# EAGLE schematic control-tu55v6 (EAGLE 6.6.0)

## Sheet 1 of 2
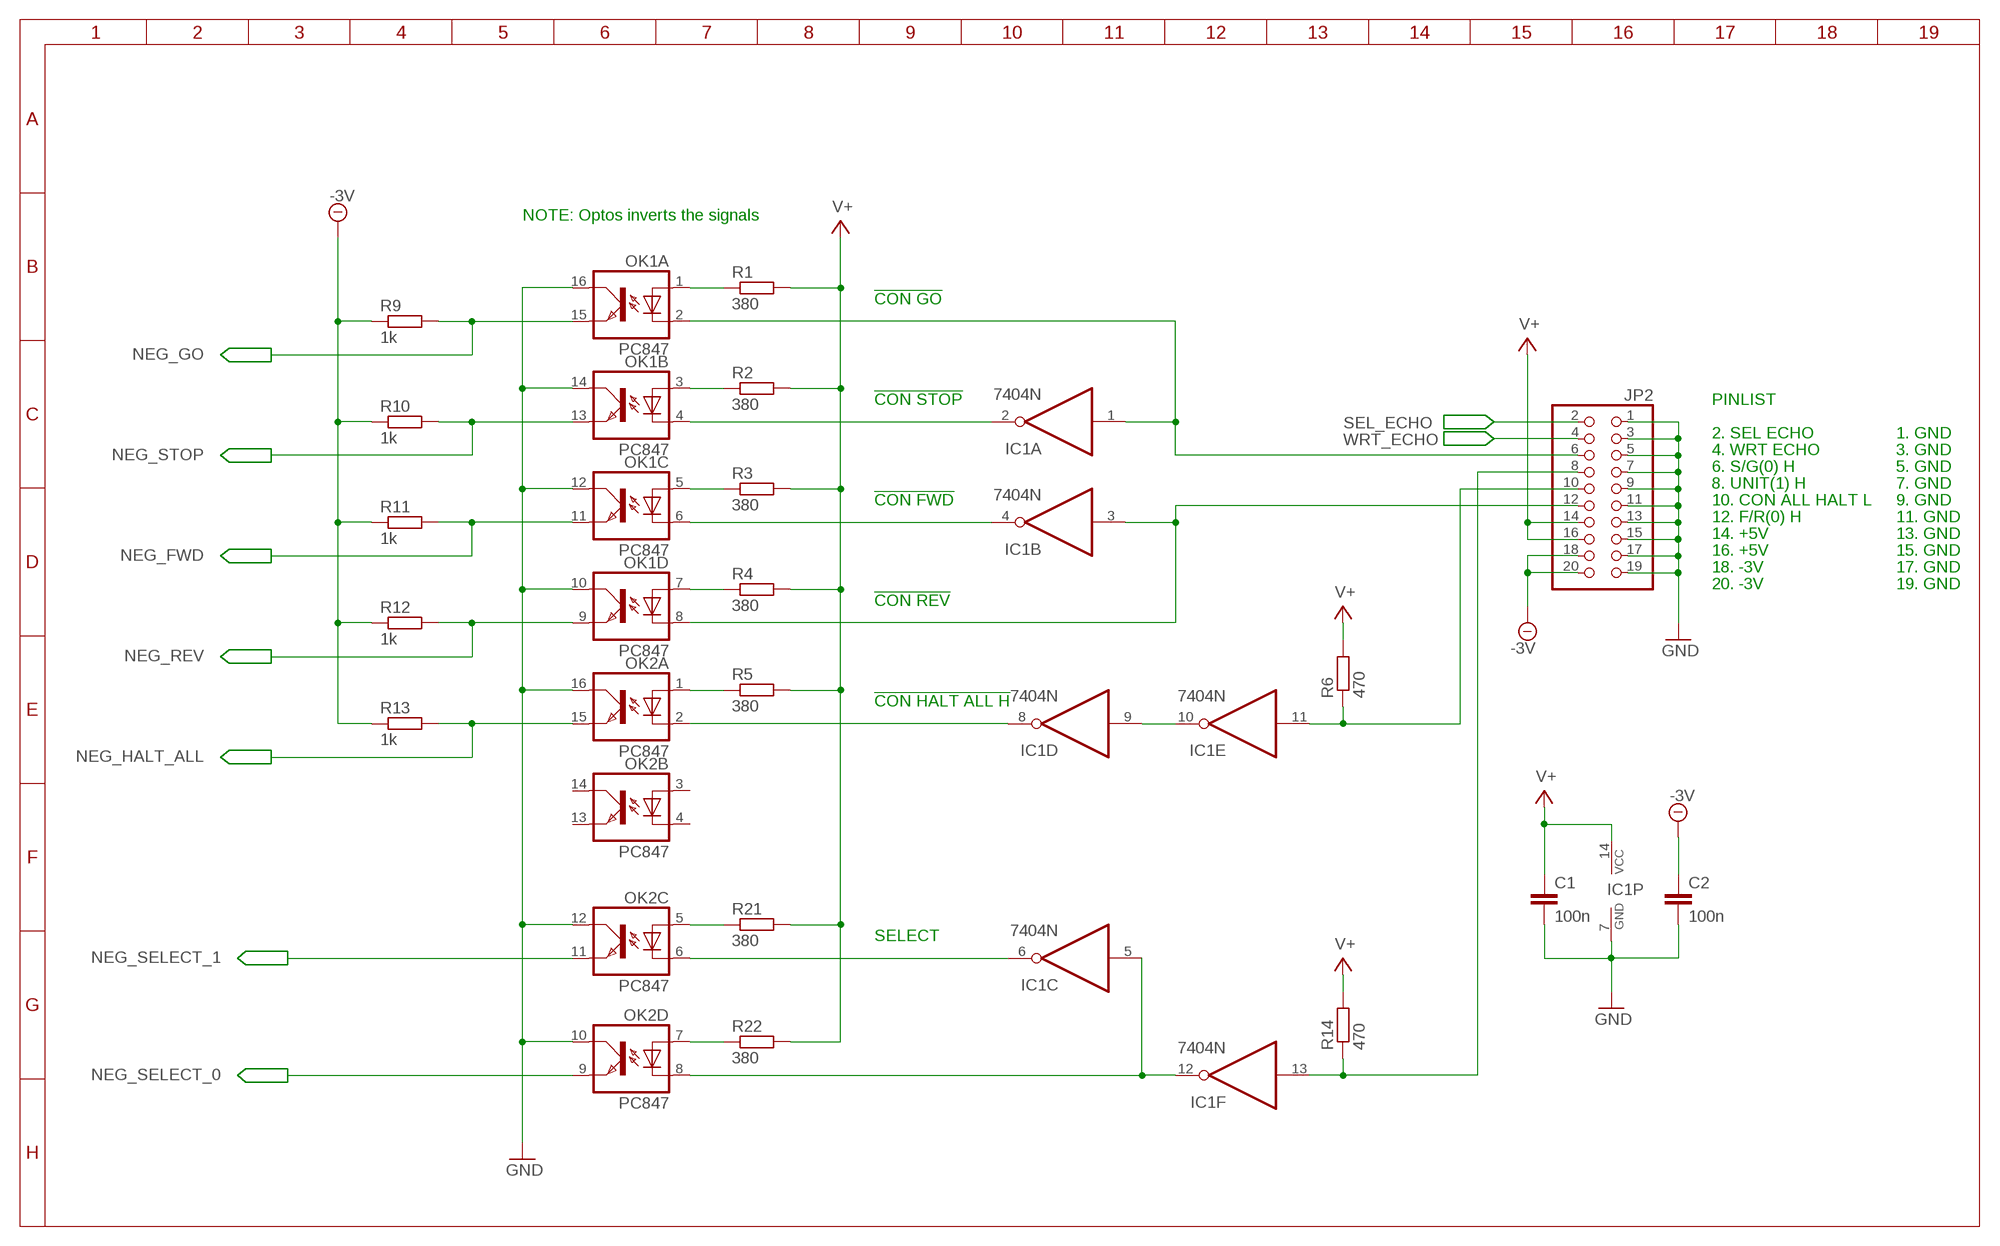
[diagram p0: schematic, sheet 1]

### Parts
C1  100n  C5/3.5  [C5B3.5]
C2  100n  C5/3.5  [C5B3.5]
IC1  7404N  [DIL14]
JP2  PINHD-2X10/90-FRAMED  [2Z10/90-FRAMED]
OK1  PC847  [DIL16]
OK2  PC847  [DIL16]
R1  380  R-EU_0207/10  [0207/10]
R2  380  R-EU_0207/10  [0207/10]
R3  380  R-EU_0207/10  [0207/10]
R4  380  R-EU_0207/10  [0207/10]
R5  380  R-EU_0207/10  [0207/10]
R6  470  R-EU_0207/10  [0207/10]
R9  1k  R-EU_0207/10  [0207/10]
R10  1k  R-EU_0207/10  [0207/10]
R11  1k  R-EU_0207/10  [0207/10]
R12  1k  R-EU_0207/10  [0207/10]
R13  1k  R-EU_0207/10  [0207/10]
R14  470  R-EU_0207/10  [0207/10]
R21  380  R-EU_0207/10  [0207/10]
R22  380  R-EU_0207/10  [0207/10]

### Nets
-3V: C2.1 JP2.18 JP2.20 R9.1 R10.1 R11.1 R12.1 R13.1 ; also sheet 2
GND: C1.2 C2.2 IC1.7(P:GND) JP2.1 JP2.3 JP2.5 JP2.7 JP2.9 JP2.11 JP2.13 JP2.15 JP2.17 JP2.19 OK1.10(D:COL) OK1.12(C:COL) OK1.14(B:COL) OK1.16(A:COL) OK2.10(D:COL) OK2.12(C:COL) OK2.16(A:COL)
N$1: IC1.9(D:I) IC1.10(E:O)
N$2: IC1.8(D:O) OK2.2(A:C)
N$3: IC1.5(C:I) IC1.12(F:O) OK2.8(D:C)
N$4: IC1.11(E:I) JP2.10 R6.1
N$10: IC1.1(A:I) JP2.6 OK1.2(A:C)
N$11: IC1.2(A:O) OK1.4(B:C)
N$15: IC1.13(F:I) JP2.8 R14.1
N$23: IC1.4(B:O) OK1.6(C:C)
N$25: OK2.5(C:A) R21.1
N$26: OK2.7(D:A) R22.1
N$27: IC1.3(B:I) JP2.12 OK1.8(D:C)
N$28: OK2.1(A:A) R5.1
N$29: OK1.7(D:A) R4.1
N$30: OK1.5(C:A) R3.1
N$31: OK1.3(B:A) R2.1
N$32: OK1.1(A:A) R1.1
N$33: IC1.6(C:O) OK2.6(C:C)
NEG_FWD: OK1.11(C:EMIT) R11.2 ; also sheet 2
NEG_GO: OK1.15(A:EMIT) R9.2 ; also sheet 2
NEG_HALT_ALL: OK2.15(A:EMIT) R13.2 ; also sheet 2
NEG_REV: OK1.9(D:EMIT) R12.2 ; also sheet 2
NEG_SELECT_0: OK2.9(D:EMIT) ; also sheet 2
NEG_SELECT_1: OK2.11(C:EMIT) ; also sheet 2
NEG_STOP: OK1.13(B:EMIT) R10.2 ; also sheet 2
SEL_ECHO: JP2.2 ; also sheet 2
V+: C1.1 IC1.14(P:VCC) JP2.14 JP2.16 R1.2 R2.2 R3.2 R4.2 R5.2 R6.2 R14.2 R21.2 R22.2
WRT_ECHO: JP2.4 ; also sheet 2
Unconnected: OK2.3(B:A) OK2.4(B:C) OK2.13(B:EMIT) OK2.14(B:COL)

### Notes on the sheet
- NOTE: Optos inverts the signals
- !CON GO
- !CON STOP | PINLIST
- 2. SEL ECHO | 1. GND
- 4. WRT ECHO | 3. GND
- 6. S/G(0) H | 5. GND
- 8. UNIT(1) H | 7. GND
- !CON FWD | 10. CON ALL HALT L | 9. GND
- 12. F/R(0) H | 11. GND
- 14. +5V | 13. GND
- 16. +5V | 15. GND
- 18. -3V | 17. GND
- 20. -3V | 19. GND
- !CON REV
- !CON HALT ALL H
- SELECT

## Sheet 2 of 2
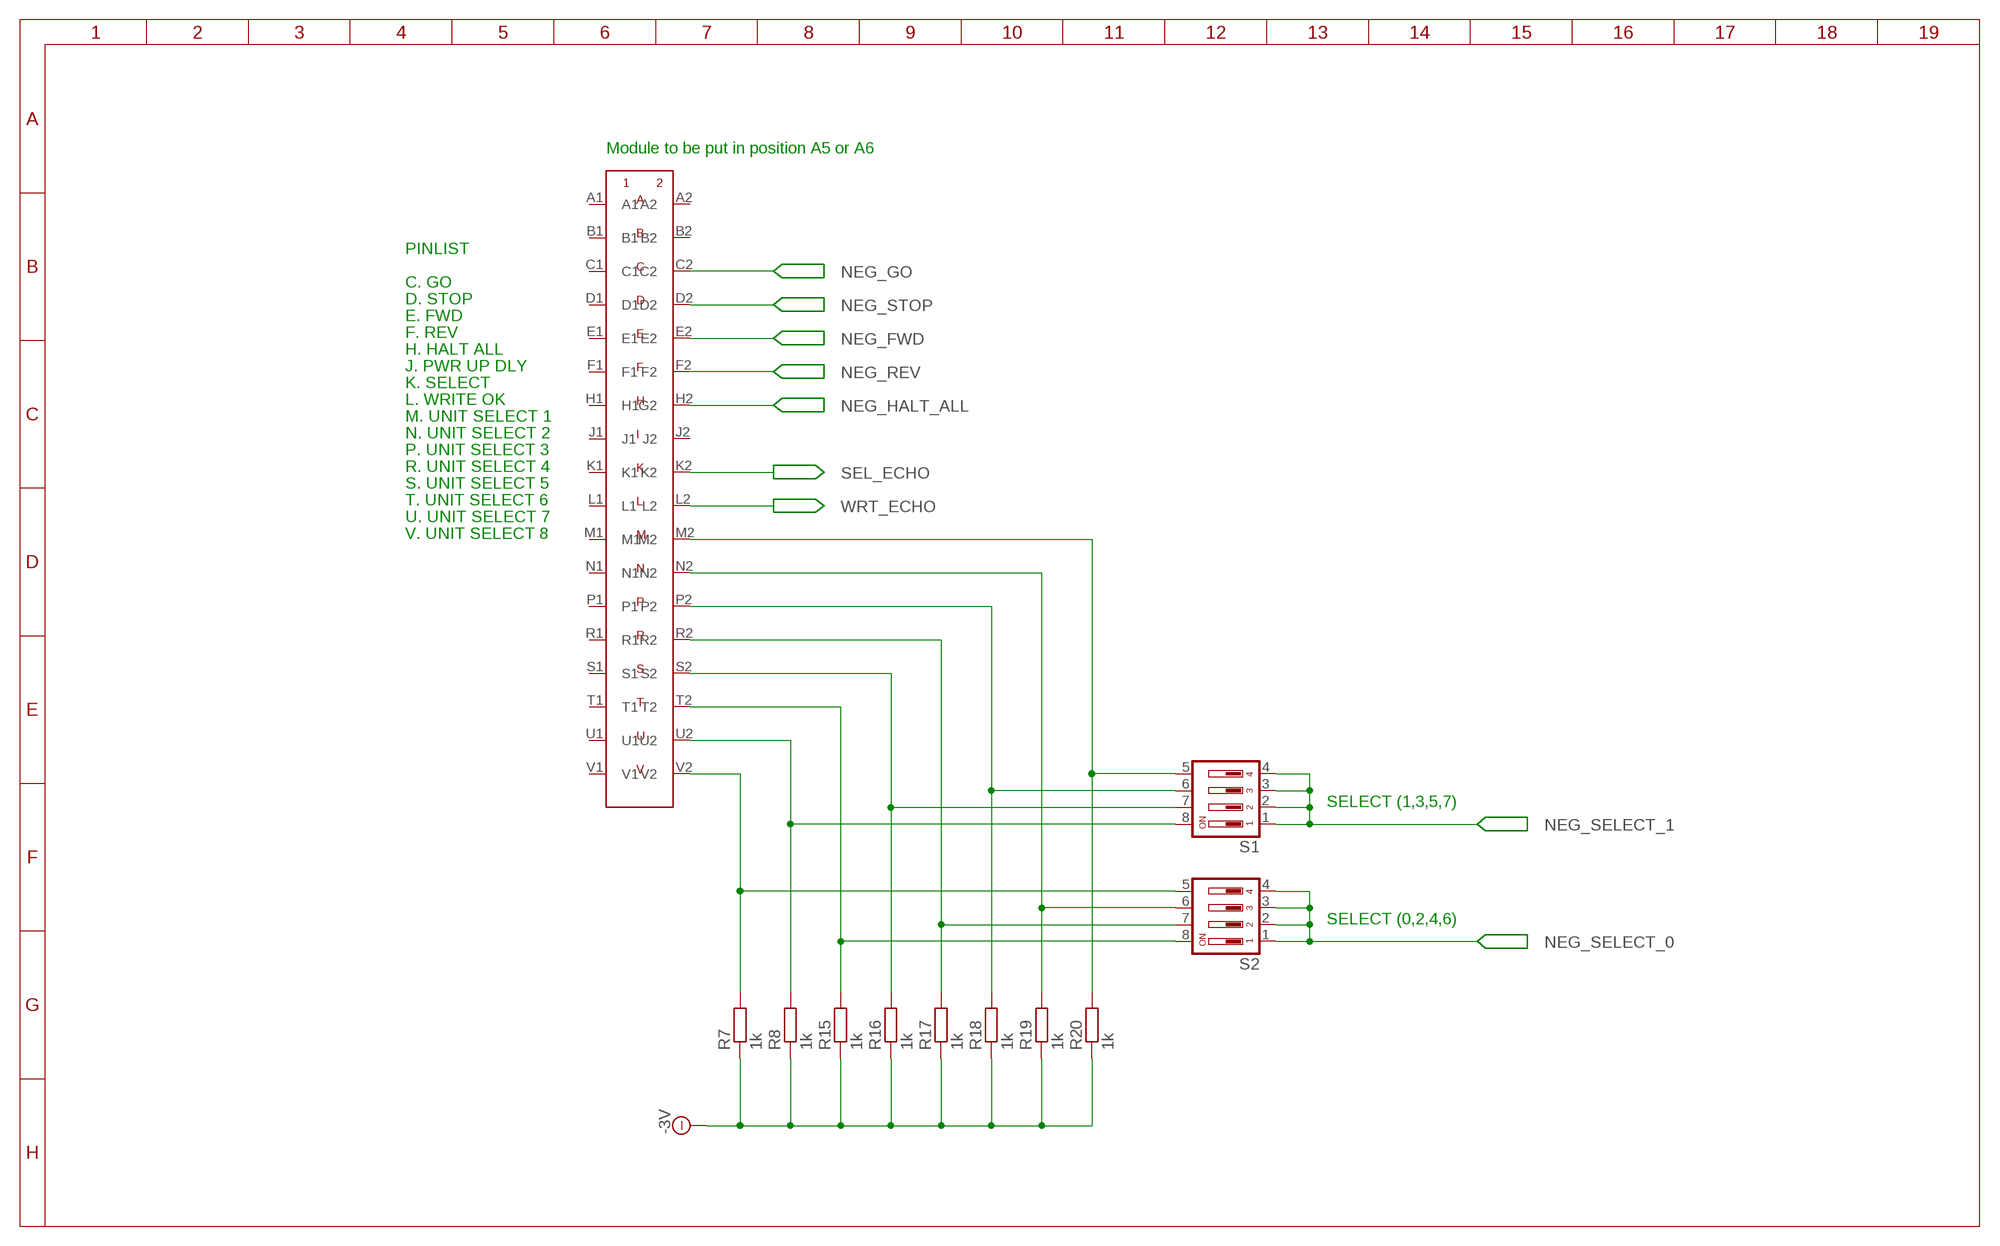
[diagram p1: schematic, sheet 2]

### Parts
CON1  FLIPCHIP_1NORMAL  [FLIPCHIP-1]
R7  1k  R-EU_0207/10  [0207/10]
R8  1k  R-EU_0207/10  [0207/10]
R15  1k  R-EU_0207/10  [0207/10]
R16  1k  R-EU_0207/10  [0207/10]
R17  1k  R-EU_0207/10  [0207/10]
R18  1k  R-EU_0207/10  [0207/10]
R19  1k  R-EU_0207/10  [0207/10]
R20  1k  R-EU_0207/10  [0207/10]
S1  DIP04YL  [DIP04YL]
S2  DIP04YL  [DIP04YL]

### Nets
-3V: R7.1 R8.1 R15.1 R16.1 R17.1 R18.1 R19.1 R20.1 ; also sheet 1
N$5: CON1.R2 R17.2 S2.7
N$6: CON1.T2 R15.2 S2.8
N$7: CON1.M2 R20.2 S1.5
N$8: CON1.V2 R7.2 S2.5
N$13: CON1.P2 R18.2 S1.6
N$14: CON1.N2 R19.2 S2.6
N$17: CON1.S2 R16.2 S1.7
N$20: CON1.U2 R8.2 S1.8
NEG_FWD: CON1.E2 ; also sheet 1
NEG_GO: CON1.C2 ; also sheet 1
NEG_HALT_ALL: CON1.H2(G2) ; also sheet 1
NEG_REV: CON1.F2 ; also sheet 1
NEG_SELECT_0: S2.1 S2.2 S2.3 S2.4 ; also sheet 1
NEG_SELECT_1: S1.1 S1.2 S1.3 S1.4 ; also sheet 1
NEG_STOP: CON1.D2 ; also sheet 1
SEL_ECHO: CON1.K2 ; also sheet 1
WRT_ECHO: CON1.L2 ; also sheet 1
Unconnected: CON1.A1 CON1.A2 CON1.B1 CON1.B2 CON1.C1 CON1.D1 CON1.E1 CON1.F1 CON1.H1 CON1.J1 CON1.J2 CON1.K1 CON1.L1 CON1.M1 CON1.N1 CON1.P1 CON1.R1 CON1.S1 CON1.T1 CON1.U1 CON1.V1

### Notes on the sheet
- Module to be put in position A5 or A6
- PINLIST
- C. GO
- D. STOP
- E. FWD
- F. REV
- H. HALT ALL
- J. PWR UP DLY
- K. SELECT
- L. WRITE OK
- M. UNIT SELECT 1
- N. UNIT SELECT 2
- P. UNIT SELECT 3
- R. UNIT SELECT 4
- S. UNIT SELECT 5
- T. UNIT SELECT 6
- U. UNIT SELECT 7
- V. UNIT SELECT 8
- SELECT (1,3,5,7)
- SELECT (0,2,4,6)

## Library data of the parts
C1 C2 = anders:C: CAPACITOR naming: grid - package width
CON1 = anders:FLIPCHIP_1: DEC Digital equipment single flipchip
IC1 = 74xx-eu:74*04: Hex INVERTER
JP2 = pinhead:PINHD-2X10: PIN HEADER
OK1 OK2 = optocoupler:PC847: SHARP OPTO COUPLER
R1-R22 = anders:R-EU_: RESISTOR, European symbol
S1 S2 = switch-dil:DIP04YL: DIL/CODE SWITCH